# EAGLE schematic pc_sensything_lite_v1.2 (EAGLE 6.6.0)

## Sheet 1 of 2
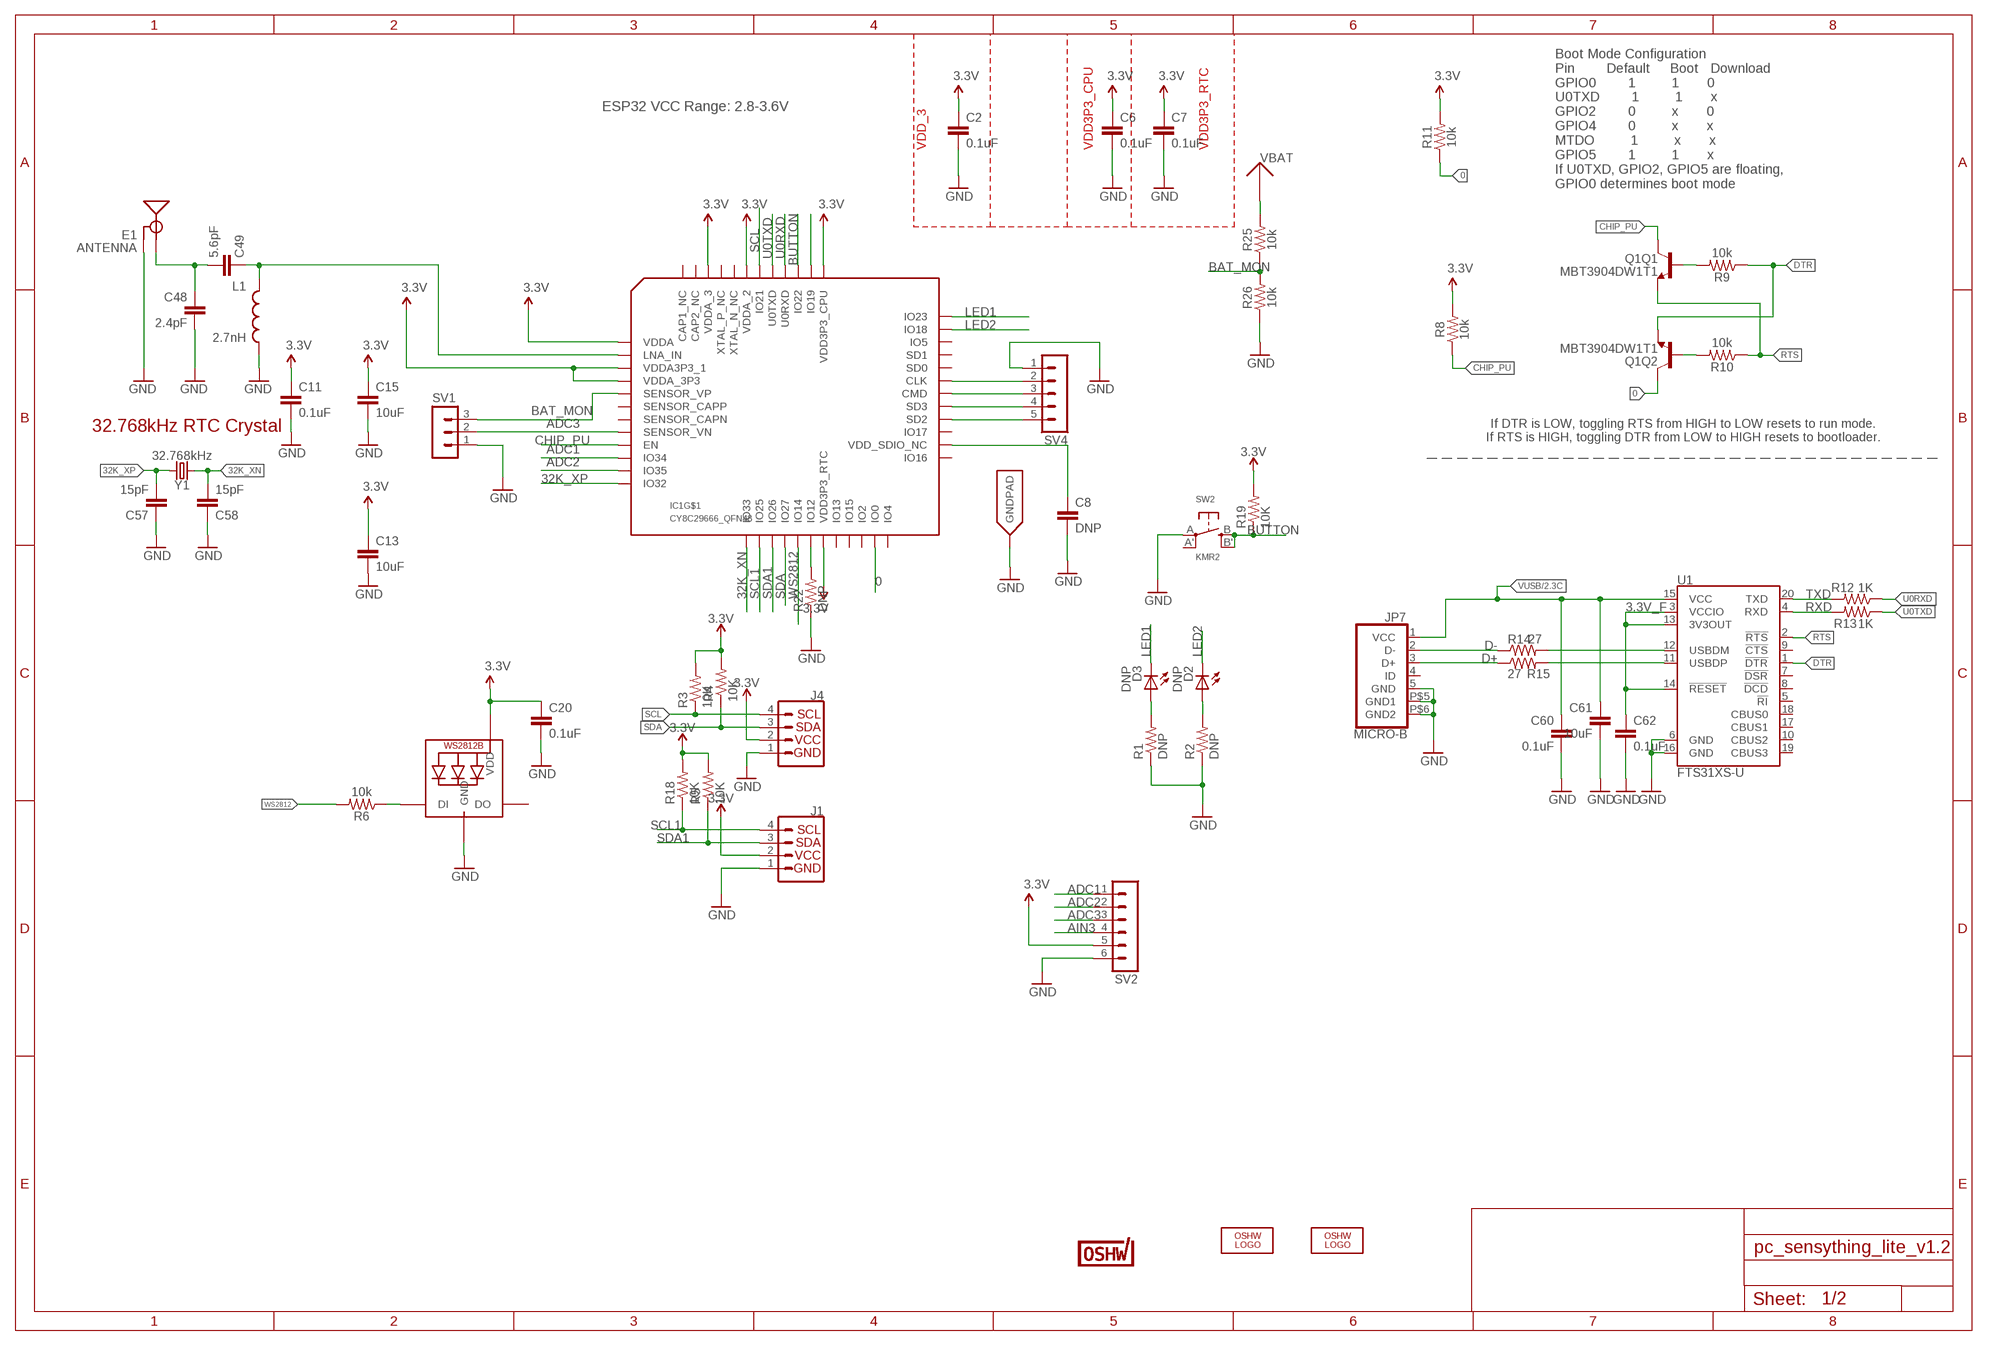
[diagram p0: schematic, sheet 1]

### Parts
C2  0.1uF  0.1UF-0402-16V-10%  [0402]
C6  0.1uF  0.1UF-0402-16V-10%  [0402]
C7  0.1uF  0.1UF-0402-16V-10%  [0402]
C8  DNP  0.1UF-0603-25V-(+80/-20%)  [0603]
C11  0.1uF  0.1UF-0402-16V-10%  [0402]
C13  10uF  C-EUC0402  [C0402]
C15  10uF  10UF-0603-6.3V-20%  [0603]
C20  0.1uF  0.1UF-0603-25V-(+80/-20%)  [0603]
C48  2.4pF  2.4PF-0603-50V-5%  [0603]
C49  5.6pF  5.6PF-50V-5%(0603)  [0603]
C57  15pF  15PF-0603-50V-5%  [0603]
C58  15pF  15PF-0603-50V-5%  [0603]
C60  0.1uF  C-EUC0402  [C0402]
C61  10uF  C-EUC0805  [C0805]
C62  0.1uF  C-EUC0402  [C0402]
D2  DNP  LEDCHIPLED_0603  [CHIPLED_0603]
D3  DNP  LEDCHIPLED_0603  [CHIPLED_0603]
E1  ANTENNA  ANTENNATRACE-TUNED  [TRACE_ANTENNA_2.4GHZ_25.7MM_TUNED]
IC1  CY8C29666_QFN48  [QFN48]
J1  QWIIC_CONNECTORJS-1MM  [1X04_1MM_RA]
J4  QWIIC_CONNECTORJS-1MM  [1X04_1MM_RA]
JP7  MICRO-B  [MICRO-B]
L1  2.7nH  INDUCTOR0603  [0603]
LED1  WS2812B5050  [WS2812B]
LOGO1  OSHW_LOGO_FILLX0200-NT  [OSHW_FILLX200_NOTEXT]
LOGO3  OSHW_LOGO_FILLX0200-NT  [OSHW_FILLX200_NOTEXT]
Q1  MBT3904DW1T1  [SC70-6]
R1  DNP  R-US_R0402  [R0402]
R2  DNP  R-US_R0402  [R0402]
R3  10K  R-US_R0402  [R0402]
R4  10K  R-US_R0402  [R0402]
R5  10K  R-US_R0402  [R0402]
R6  10k  10KOHM-1/10W-1%(0603)0603  [0603]
R8  10k  10KOHM-1/10W-1%(0603)0603  [0603]
R9  10k  10KOHM-0603-1/10W-1%  [0603]
R10  10k  10KOHM-0603-1/10W-1%  [0603]
R11  10k  10KOHM-1/10W-1%(0603)0603  [0603]
R12  1K  R-US_R0402  [R0402]
R13  1K  R-US_R0402  [R0402]
R14  27  R-US_R0402  [R0402]
R15  27  R-US_R0402  [R0402]
R18  10K  R-US_R0402  [R0402]
R19  10K  R-US_R0402  [R0402]
R22  DNP  R-US_R0402  [R0402]
R25  10k  10KOHM-1/10W-1%(0603)0603  [0603]
R26  10k  10KOHM-1/10W-1%(0603)0603  [0603]
SV1  MA03-1  [MA03-1]
SV2  MA06-1  [MA06-1]
SV4  MA05-1  [MA05-1]
SW2  KMR2  SWITCH_TACT_SMT4.6X2.8  [BTN_KMR2_4.6X2.8]
U1  FTS31XS-U  FT231XS  [SSOP20_L]
U$22  CERT-SMALL  [CERT-SMALL-SILK]
Y1  32.768kHz  CRYSTAL-32.768KHZSMD-3.2X1.5  [CRYSTAL-SMD-3.2X1.5MM]

### Nets
0: IC1.23(IO0) Q1.6(Q2:C) R11.1
3.3V: C2.1 C6.1 C7.1 C11.1 C13.1 C15.1 C20.1 IC1.1(VDDA) IC1.3(VDDA3P3_1) IC1.4(VDDA_3P3) IC1.19(VDD3P3_RTC) IC1.37(VDD3P3_CPU) IC1.43(VDDA_2) IC1.46(VDDA_3) J1.2 J4.2 LED1.1-VDD(VDD) R3.2 R4.2 R5.2 R8.2 R11.2 R18.2 R19.2 SV2.5 ; also sheet 2
3.3V_F: C62.1 U1.3(VCCIO) U1.13(3V3OUT) U1.14(!RESET)
32K_XN: C58.2 IC1.13(IO33) Y1.P$2
32K_XP: C57.2 IC1.12(IO32) Y1.P$1
ADC1: IC1.10(IO34) SV2.1
ADC2: IC1.11(IO35) SV2.2
ADC3: IC1.8(SENSOR_VN) SV1.2 SV2.3
AIN3: SV2.4
BAT_MON: IC1.5(SENSOR_VP) R25.1 R26.2 SV1.3
BUTTON: IC1.39(IO22) R19.1 SW2.B'(S1) SW2.B(S)
CHIP_PU: IC1.9(EN) Q1.3(Q1:C) R8.1
D+: JP7.3(D+) R15.1
D-: JP7.2(D-) R14.1
DTR: Q1.1(Q2:E) R9.1 U1.1(!DTR)
GND: C2.2 C6.2 C7.2 C8.2 C11.2 C13.2 C15.2 C20.2 C48.2 C57.1 C58.1 C60.2 C61.2 C62.2 E1.GND E1.GND2(GND) IC1.EXP(GNDPAD) J1.1 J4.1 JP7.5(GND) JP7.P$5(GND1) JP7.P$6(GND2) L1.2 LED1.3-GND(GND) R1.1 R2.1 R22.1 R26.1 SV1.1 SV2.6 SV4.1 SW2.A(P) U1.6(GND) U1.16(GND) ; also sheet 2
LED1: D3.C IC1.36(IO23)
LED2: D2.C IC1.35(IO18)
LNA_IN: C49.1 IC1.2(LNA_IN) L1.1
N$1: C8.1 IC1.26(VDD_SDIO_NC)
N$2: IC1.18(IO12) R22.2
N$3: D3.A R1.2
N$4: Q1.5(Q1:B) R9.2
N$5: D2.A R2.2
N$6: LED1.4-DIN(DI) R6.1
N$8: IC1.38(IO19)
N$9: Q1.2(Q2:B) R10.2
N$11: IC1.28(SD2) SV4.5
N$12: IC1.29(SD3) SV4.4
N$13: IC1.30(CMD) SV4.3
N$14: IC1.31(CLK) SV4.2
N$20: R14.2 U1.12(USBDM)
N$21: R15.2 U1.11(USBDP)
RTS: Q1.4(Q1:E) R10.1 U1.2(!RTS)
RXD: R13.2 U1.4(RXD)
SCL: IC1.42(IO21) J4.4 R3.1
SCL1: IC1.14(IO25) J1.4 R18.1
SDA: IC1.16(IO27) J4.3 R4.1
SDA1: IC1.15(IO26) J1.3 R5.1
TRACE_ANT2: C48.1 C49.2 E1.ANT(SIGNAL)
TXD: R12.2 U1.20(TXD)
U0RXD: IC1.40(U0RXD) R12.1
U0TXD: IC1.41(U0TXD) R13.1
VBAT: R25.2 ; also sheet 2
VUSB: C60.1 C61.1 JP7.1(VCC) U1.15(VCC) ; also sheet 2
WS2812: IC1.17(IO14) R6.2
Unconnected: IC1.6(SENSOR_CAPP) IC1.20(IO13) IC1.21(IO15) IC1.22(IO2) IC1.24(IO4) IC1.25(IO16) IC1.27(IO17) IC1.32(SD0) IC1.33(SD1) IC1.34(IO5) IC1.44(XTAL_N_NC) IC1.45(XTAL_P_NC) IC1.47(CAP2_NC) IC1.48(CAP1_NC) JP7.4(ID) LED1.2-DOUT(DO) SW2.A'(P1) U1.5(!RI) U1.7(!DSR) U1.8(!DCD) U1.9(!CTS) U1.10(CBUS2) U1.17(CBUS1) U1.18(CBUS0) U1.19(CBUS3)

### Notes on the sheet
- ESP32 VCC Range: 2.8-3.6V
- VDD_3 | VDD3P3_CPU | VDD3P3_RTC
- Boot Mode Configuration
  Pin        Default     Boot   Download
  GPIO0        1         1       0
  U0TXD        1         1       x
  GPIO2        0         x       0
  GPIO4        0         x       x
  MTDO         1         x       x
  GPIO5        1         1       x
  If U0TXD, GPIO2, GPIO5 are floating, 
  GPIO0 determines boot mode
- 32.768kHz RTC Crystal
- If DTR is LOW, toggling RTS from HIGH to LOW resets to run mode.
  If RTS is HIGH, toggling DTR from LOW to HIGH resets to bootloader.

## Sheet 2 of 2
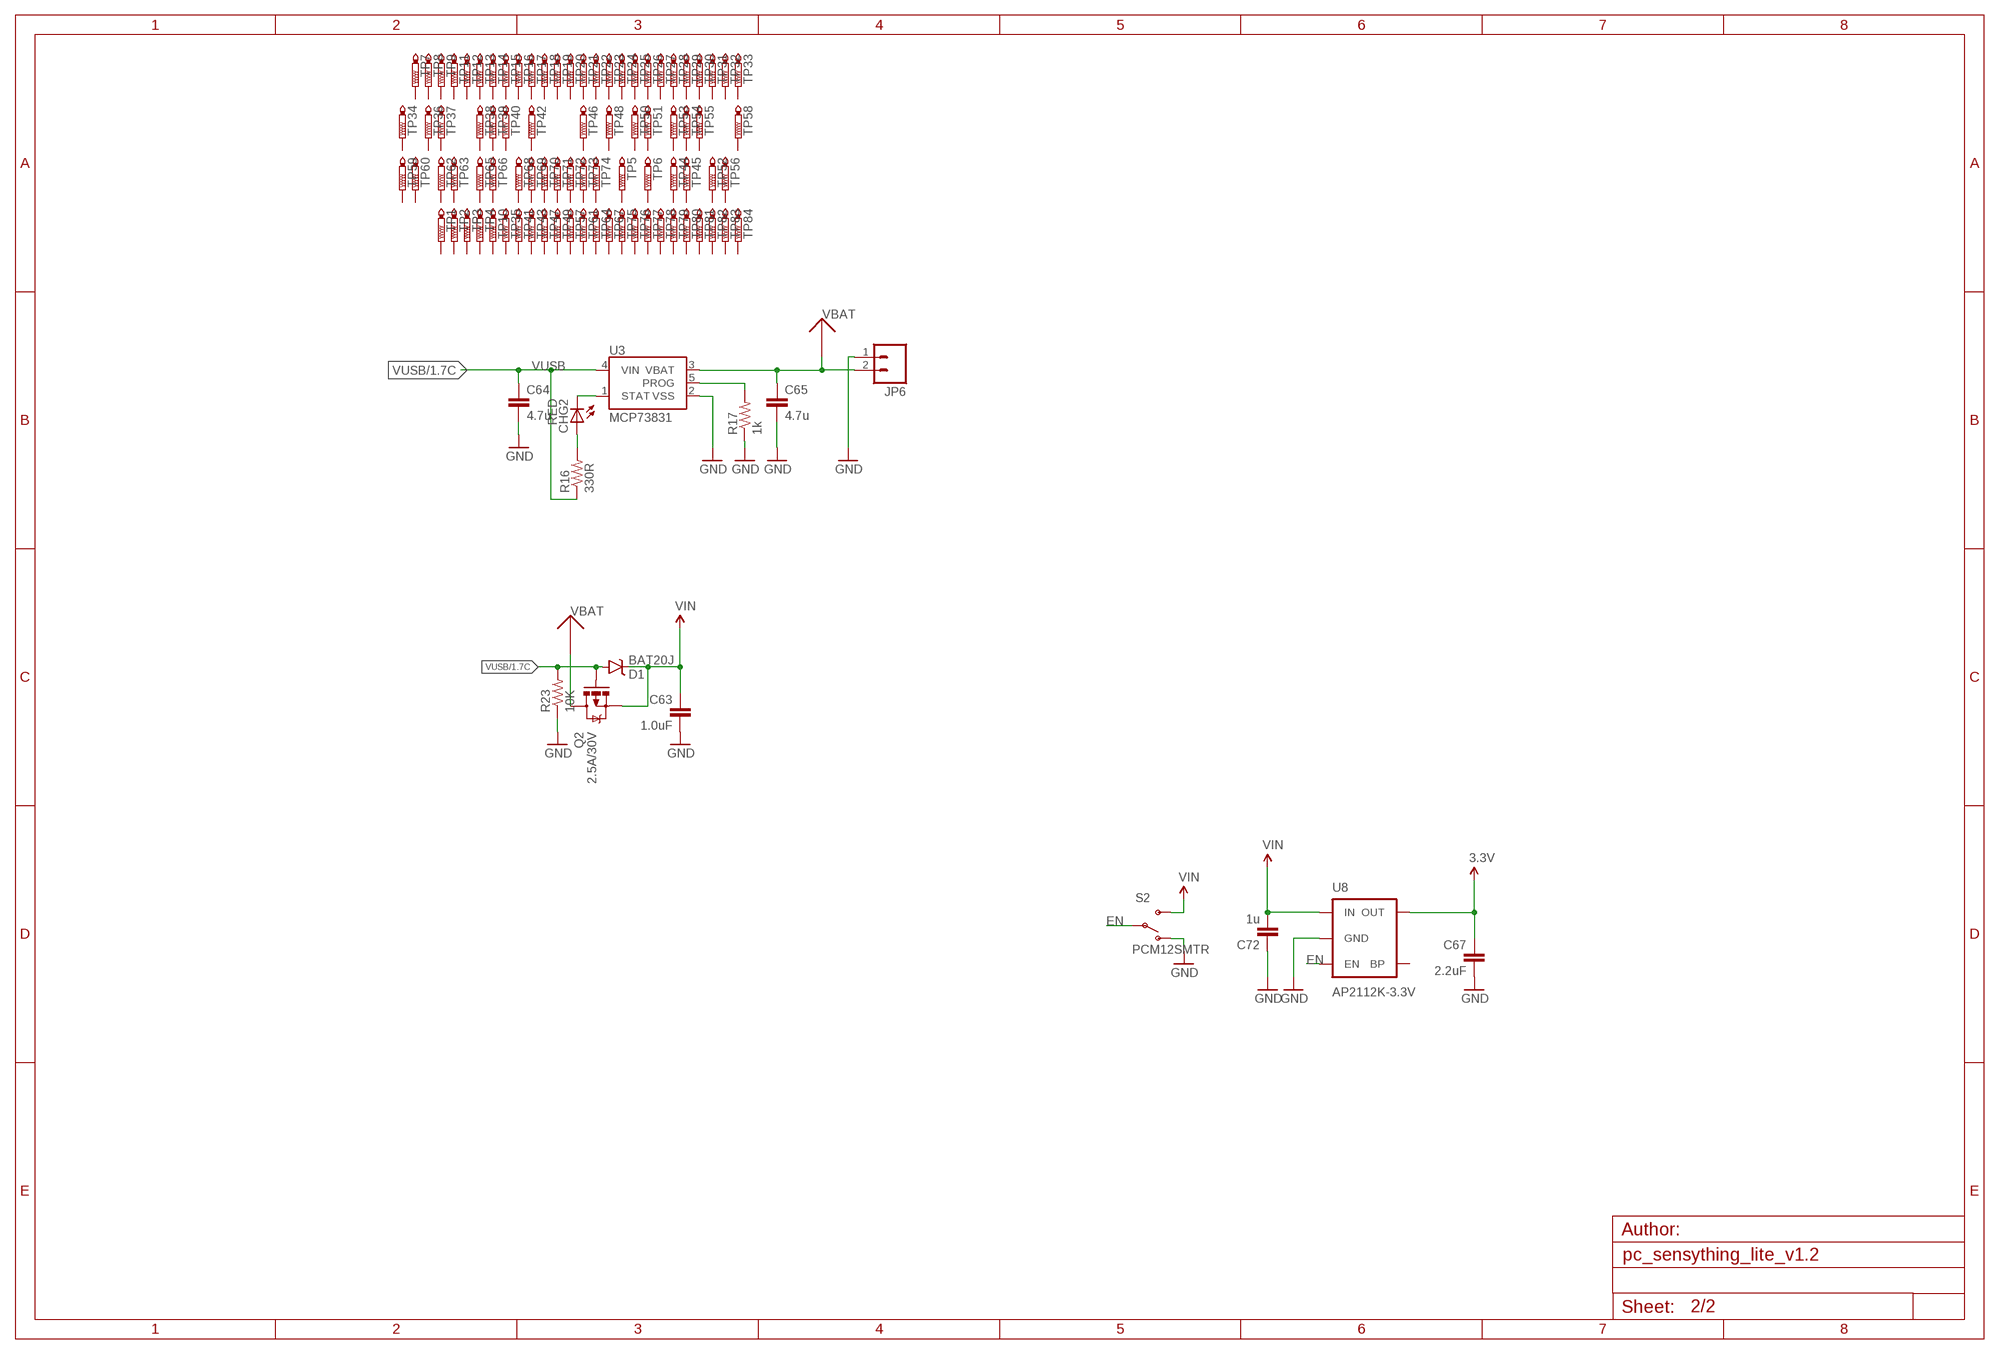
[diagram p1: schematic, sheet 2]

### Parts
C63  1.0uF  C-EUC0402  [C0402]
C64  4.7u  C-EUC0805  [C0805]
C65  4.7u  C-EUC0805  [C0805]
C67  2.2uF  C-EUC0402  [C0402]
C72  1u  C-EUC0402  [C0402]
CHG2  RED  LEDCHIPLED_0603  [CHIPLED_0603]
D1  BAT20J  DIODE-SCHOTTKY-BAT20J  [SOD-323]
JP6  M02-JST-2MM-SMT  [JST-2-SMD]
Q2  2.5A/30V  MOSFET-PCHANNELDMG2307L  [SOT23-3]
R16  330R  R-US_R0402  [R0402]
R17  1k  R-US_R0402  [R0402]
R23  10K  R-US_R0402  [R0402]
S2  PCM12SMTR  SWITCH-SPDT-SMD-A  [SWITCH-SPST-SMD-A]
TP1  PTR1PAD1-13  [P1-13]
TP2  PTR1PAD1-13  [P1-13]
TP3  PTR1PAD1-13  [P1-13]
TP4  PTR1PAD1-13  [P1-13]
TP5  PTR1PAD1-13  [P1-13]
TP6  PTR1PAD1-13  [P1-13]
TP7  PTR1PAD1-13  [P1-13]
TP8  PTR1PAD1-13  [P1-13]
TP9  PTR1PAD1-13  [P1-13]
TP10  PTR1PAD1-13  [P1-13]
TP11  PTR1PAD1-13  [P1-13]
TP12  PTR1PAD1-13  [P1-13]
TP13  PTR1PAD1-13  [P1-13]
TP14  PTR1PAD1-13  [P1-13]
TP15  PTR1PAD1-13  [P1-13]
TP16  PTR1PAD1-13  [P1-13]
TP17  PTR1PAD1-13  [P1-13]
TP18  PTR1PAD1-13  [P1-13]
TP19  PTR1PAD1-13  [P1-13]
TP20  PTR1PAD1-13  [P1-13]
TP21  PTR1PAD1-13  [P1-13]
TP22  PTR1PAD1-13  [P1-13]
TP23  PTR1PAD1-13  [P1-13]
TP24  PTR1PAD1-13  [P1-13]
TP25  PTR1PAD1-13  [P1-13]
TP26  PTR1PAD1-13  [P1-13]
TP27  PTR1PAD1-13  [P1-13]
TP28  PTR1PAD1-13  [P1-13]
TP29  PTR1PAD1-13  [P1-13]
TP30  PTR1PAD1-13  [P1-13]
TP31  PTR1PAD1-13  [P1-13]
TP32  PTR1PAD1-13  [P1-13]
TP33  PTR1PAD1-13  [P1-13]
TP34  PTR1PAD1-13  [P1-13]
TP35  PTR1PAD1-13  [P1-13]
TP36  PTR1PAD1-13  [P1-13]
TP37  PTR1PAD1-13  [P1-13]
TP38  PTR1PAD1-13  [P1-13]
TP39  PTR1PAD1-13  [P1-13]
TP40  PTR1PAD1-13  [P1-13]
TP41  PTR1PAD1-13  [P1-13]
TP42  PTR1PAD1-13  [P1-13]
TP43  PTR1PAD1-13  [P1-13]
TP44  PTR1PAD1-13  [P1-13]
TP45  PTR1PAD1-13  [P1-13]
TP46  PTR1PAD1-13  [P1-13]
TP47  PTR1PAD1-13  [P1-13]
TP48  PTR1PAD1-13  [P1-13]
TP49  PTR1PAD1-13  [P1-13]
TP50  PTR1PAD1-13  [P1-13]
TP51  PTR1PAD1-13  [P1-13]
TP52  PTR1PAD1-13  [P1-13]
TP53  PTR1PAD1-13  [P1-13]
TP54  PTR1PAD1-13  [P1-13]
TP55  PTR1PAD1-13  [P1-13]
TP56  PTR1PAD1-13  [P1-13]
TP57  PTR1PAD1-13  [P1-13]
TP58  PTR1PAD1-13  [P1-13]
TP59  PTR1PAD1-13  [P1-13]
TP60  PTR1PAD1-13  [P1-13]
TP61  PTR1PAD1-13  [P1-13]
TP62  PTR1PAD1-13  [P1-13]
TP63  PTR1PAD1-13  [P1-13]
TP64  PTR1PAD1-13  [P1-13]
TP65  PTR1PAD1-13  [P1-13]
TP66  PTR1PAD1-13  [P1-13]
TP67  PTR1PAD1-13  [P1-13]
TP68  PTR1PAD1-13  [P1-13]
TP69  PTR1PAD1-13  [P1-13]
TP70  PTR1PAD1-13  [P1-13]
TP71  PTR1PAD1-13  [P1-13]
TP72  PTR1PAD1-13  [P1-13]
TP73  PTR1PAD1-13  [P1-13]
TP74  PTR1PAD1-13  [P1-13]
TP75  PTR1PAD1-13  [P1-13]
TP76  PTR1PAD1-13  [P1-13]
TP77  PTR1PAD1-13  [P1-13]
TP78  PTR1PAD1-13  [P1-13]
TP79  PTR1PAD1-13  [P1-13]
TP80  PTR1PAD1-13  [P1-13]
TP81  PTR1PAD1-13  [P1-13]
TP82  PTR1PAD1-13  [P1-13]
TP83  PTR1PAD1-13  [P1-13]
TP84  PTR1PAD1-13  [P1-13]
U3  MCP73831  [SOT23-5]
U8  AP2112K-3.3V  V_REG_LDOSMD  [SOT23-5]

### Nets
3.3V: C67.1 U8.5(OUT) ; also sheet 1
EN: S2.2(P) U8.3(EN)
GND: C63.2 C64.2 C65.2 C67.2 C72.1 JP6.1 R17.1 R23.1 S2.1(O) U3.2(VSS) U8.2(GND) ; also sheet 1
N$22: CHG2.C U3.1(STAT)
N$29: CHG2.A R16.2
N$31: R17.2 U3.5(PROG)
VBAT: C65.1 JP6.2 Q2.3(D) U3.3(VBAT) ; also sheet 1
VIN: C63.1 C72.2 D1.C Q2.2(S) S2.3(S) U8.1(IN)
VUSB: C64.1 D1.A Q2.1(G) R16.1 R23.2 U3.4(VIN) ; also sheet 1
Unconnected: TP1.TP TP2.TP TP3.TP TP4.TP TP5.TP TP6.TP TP7.TP TP8.TP TP9.TP TP10.TP TP11.TP TP12.TP TP13.TP TP14.TP TP15.TP TP16.TP TP17.TP TP18.TP TP19.TP TP20.TP TP21.TP TP22.TP TP23.TP TP24.TP TP25.TP TP26.TP TP27.TP TP28.TP TP29.TP TP30.TP TP31.TP TP32.TP TP33.TP TP34.TP TP35.TP TP36.TP TP37.TP TP38.TP TP39.TP TP40.TP TP41.TP TP42.TP TP43.TP TP44.TP TP45.TP TP46.TP TP47.TP TP48.TP TP49.TP TP50.TP TP51.TP TP52.TP TP53.TP TP54.TP TP55.TP TP56.TP TP57.TP TP58.TP TP59.TP TP60.TP TP61.TP TP62.TP TP63.TP TP64.TP TP65.TP TP66.TP TP67.TP TP68.TP TP69.TP TP70.TP TP71.TP TP72.TP TP73.TP TP74.TP TP75.TP TP76.TP TP77.TP TP78.TP TP79.TP TP80.TP TP81.TP TP82.TP TP83.TP TP84.TP U8.4(BP)

## Power pins joined to a net without a drawn wire
SENSOR_CAPN: IC1.7(SENSOR_CAPN)

## Library data of the parts
C2 C6 C7 C11 = SparkFun-Capacitors:0.1UF: 0.1µF ceramic capacitors A capacitor is a passive two-terminal electrical component used to store electrical energy temporarily in an electric field.; PROD_ID: CAP-12416
C8 = SparkFun-Capacitors:0.1UF: 0.1µF ceramic capacitors A capacitor is a passive two-terminal electrical component used to store electrical energy temporarily in an electric field.; PROD_ID: CAP-00810; VALUE: 0.1uF
C13 C60-C65 C67 C72 = rcl:C-EU: CAPACITOR, European symbol
C15 = SparkFun-Capacitors:10UF: 10.0µF ceramic capacitors A capacitor is a passive two-terminal electrical component used to store electrical energy temporarily in an electric field.; PROD_ID: CAP-11015
C20 = SparkFun-Capacitors:0.1UF: 0.1µF ceramic capacitors A capacitor is a passive two-terminal electrical component used to store electrical energy temporarily in an electric field.; PROD_ID: CAP-00810
C48 = esp32-thing-temp:2.4PF: 2.4pF ceramic capacitors A capacitor is a passive two-terminal electrical component used to store electrical energy temporarily in an electric field.; PROD_ID: CAP-13541
C49 = esp32-thing-temp:5.6PF-50V-5%(0603): CAP-12456; PROD_ID: CAP-12456
C57 C58 = SparkFun-Capacitors:15PF: 15pF ceramic capacitors A capacitor is a passive two-terminal electrical component used to store electrical energy temporarily in an electric field.; PROD_ID: CAP-07881
CHG2 D2 D3 = led:LED: LED OSRAM: - CHIPLED LG R971, LG N971, LY N971, LG Q971, LY Q971, LO R971, LY R971 LH N974, LH R974 LS Q976, LO Q976, LY Q976 LO Q996 - Hyper CHIPLED LW Q18S LB Q993, LB Q99A, LB R99A - SideLED LS A670, LO A670, LY A670, LG A670, LP A670 LB A673, LV A673, LT A673, LW A673 LH A674 LY A675 LS A676, LA A676, LO A676, LY A676, LW A676 LS A679, LY A679, LG A679 - Hyper Micro SIDELED® LS Y876, LA Y876, LO Y876, LY Y876 LT Y87S - SmartLED LW L88C, LW L88S LB L89C, LB L89S, LG L890 LS L89K, LO L89K, LY L89K LS L896, LA L896, LO L896, LY L896 - TOPLED LS T670, LO T670, LY T670, LG T670, LP T670 LSG T670, LSP T670, LSY T670, LOP T670, LYG T670 LG T671, LOG T671, LSG T671 LB T673, LV T673, LT T673, LW T673 LH T674 LS T676, LA T676, LO T676, LY T676, LB T676, LH T676, LSB T676, LW T676 LB T67C, LV T67C, LT T67C, LS T67K, LO T67K, LY T67K, LW E67C LS E67B, LA E67B, LO E67B, LY E67B, LB E67C, LV E67C, LT E67C LW T67C LS T679, LY T679, LG T679 LS T770, LO T770, LY T770, LG T770, LP T770 LB T773, LV T773, LT T773, LW T773 LH T774 LS E675, LA E675, LY E675, LS T675 LS T776, LA T776, LO T776, LY T776, LB T776 LHGB T686 LT T68C, LB T68C - Hyper Mini TOPLED® LB M676 - Mini TOPLED Santana® LG M470 LS M47K, LO M47K, LY M47K Source: http://www.osram.convergy.de LUXEON: - LUMILED® LXK2-PW12-R00, LXK2-PW12-S00, LXK2-PW14-U00, LXK2-PW14-V00 LXK2-PM12-R00, LXK2-PM12-S00, LXK2-PM14-U00 LXK2-PE12-Q00, LXK2-PE12-R00, LXK2-PE12-S00, LXK2-PE14-T00, LXK2-PE14-U00 LXK2-PB12-K00, LXK2-PB12-L00, LXK2-PB12-M00, LXK2-PB14-N00, LXK2-PB14-P00, LXK2-PB14-Q00 LXK2-PR12-L00, LXK2-PR12-M00, LXK2-PR14-Q00, LXK2-PR14-R00 LXK2-PD12-Q00, LXK2-PD12-R00, LXK2-PD12-S00 LXK2-PH12-R00, LXK2-PH12-S00 LXK2-PL12-P00, LXK2-PL12-Q00, LXK2-PL12-R00 Source: www.luxeon.com KINGBRIGHT: KA-3528ASYC Source: www.kingbright.com
D1 = SparkFun-DiscreteSemi:DIODE-SCHOTTKY: Schottky diodes in SFE's production catalog BAT20J 1A 23V 0.62Vf RB751 120mA 40V 0.37Vf PMEG4005EJ 0.5A 40V 0.42Vf MBRA140 1A 40V 0.5Vf B340A 3A 40V SMA; PROD_ID: DIO-11623
E1 = esp32-thing-temp:ANTENNA: Chip antenna Chip antenna with ground or secondary connection. Common with larger metal RF connectors.
IC1 = cypresspsoc_0.30:CY8C29666_QFN48
J1 J4 = SparkFun-Connectors:QWIIC_CONNECTOR: SparkFun I2C Standard Qwiic Connector An SMD 1mm pitch JST connector makes it easy and quick (get it? Qwiic?) to connect I2C devices to each other. The Qwiic system <http://www.sparkfun.com/qwiic> enables fast and solderless connection between popular platforms and various sensors and actuators. We carry 200mm <https://www.sparkfun.com/products/14204>, 100mm <https://www.sparkfun.com/products/14205>, 50mm <https://www.sparkfun.com/products/14206>, and breadboard friendly <https://www.sparkfun.com/products/14207> Qwiic cables. We also offer 10 pcs strips <https://www.sparkfun.com/products/14323> the SMD connectors.; PROD_ID: CONN-13694
JP6 = SparkFun:M02: Header 2 Standard 2-pin 0.1" header. Use with straight break away headers (SKU : PRT-00116), right angle break away headers (PRT-00553), swiss pins (PRT-00743), machine pins (PRT-00117), and female headers (PRT-00115). Molex polarized connector foot print use with SKU : PRT-08233 with associated crimp pins and housings.
JP7 = circuitects:MICRO-B
L1 = SparkFun-Passives:INDUCTOR: Inductors Basic Inductor/Choke - 0603 and 1206. Footprints are not proven and vary greatly between part numbers. INDUCTOR POWER 3.3UH 4.0A SMD 0.197" L x 0.197" W x 0.177" H (5.00mm x 5.00mm x 4.50mm); PROD_ID: NDUC-08762
LED1 = adafruit:WS2812B
LOGO1 LOGO3 = ohw-logo:OSHW_LOGO_FILL
Q1 = esp32-thing-temp:MBT3904DW1T1: MBT3904DW1 Dual NPN Transistors The MBT3904W1 puts two general purpose 3904 NPN transistors in a single package. Datasheet <http://www.onsemi.com/pub_link/Collateral/MBT3904DW1T1-D.PDF>; PROD_ID: TRANS-13337
Q2 = SparkFun-DiscreteSemi:MOSFET-PCHANNEL: Generic PMOSFET IRLML2244 - TRANS-11153 (SOT-23 -20V -4.3A) (1.Gate 2.Source 3.Drain) FQP27P06 - COM-10349 <http://www.sparkfun.com/products/10349> (TO-220 -60V -27A) (1.Gate 2.Source 3.Drain); PROD_ID: TRANS-11308
R1-R5 R12-R19 R22 R23 = rcl:R-US_: RESISTOR, American symbol
R6 R8 R11 R25 R26 = SparkFun-Resistors:10KOHM-1/10W-1%(0603): RES-00824; PROD_ID: RES-00824; VALUE: 10K
R9 R10 = SparkFun-Resistors:10KOHM: 10kΩ resistor A resistor is a passive two-terminal electrical component that implements electrical resistance as a circuit element. Resistors act to reduce current flow, and, at the same time, act to lower voltage levels within circuits. - Wikipedia; PROD_ID: RES-00824
S2 = SparkFun-Electromechanical:SWITCH-SPDT: SPDT Switch Simple slide switch, Spark Fun Electronics SKU : COM-00102 DPDT SMT slide switch, AYZ0202, SWCH-08179; PROD_ID: SWCH-10651
SV1 = con-lstb:MA03-1: PIN HEADER; OC_FARNELL: unknown; OC_NEWARK: unknown
SV2 = con-lstb:MA06-1: PIN HEADER; OC_FARNELL: unknown; OC_NEWARK: unknown
SV4 = con-lstb:MA05-1: PIN HEADER; OC_FARNELL: unknown; OC_NEWARK: unknown
SW2 = microbuilder:SWITCH_TACT_SMT: SMT Tact Switches 6x6mm - Digikey: P12940SCT-ND KMR2 (4.6x2.8mm) - Digikey: 401-1426-1-ND EVQ-PQHB55 - Light Touch, 160GF (4.5x4.5mm) - Digikey: P8090SCT-ND KMT0 - KMT021 NGJ LHS (etc.) IP68/Waterproof - Digikey: CKN10289CT-ND
TP1-TP84 = testpad:PTR1: TEST PIN
U1 = SparkFun-DigitalIC:FT231X: FTDI FT231X Full Speed USB to Full-handshake UART This USB2.0 Full Speed IC offers a compact bridge to full handshake UART interfaces. The device is a UART, capable of operating up to 3MBaud, with low power consumption (8mA). The FT231X includes the complete FT-X series feature set and enables USB to be added into a system design quickly and easily over a UART interface.; PROD_ID: IC-11524; VALUE: FT231XS
U3 = SparkFun:MCP73831: Microchip's MCP73831 Miniature single cell, fully integrated Li-Ion, Li-polymer charge management controller http://ww1.microchip.com/downloads/en/DeviceDoc/21984a.pdf
U8 = SparkFun-PowerIC:V_REG_LDO: Voltage Regulator LDO Standard 150mA LDO voltage regulator in SOT-23 layout. Micrel part MIC5205. BP (by-pass) pin is used to lower output noise with 470pF cap.; PROD_ID: VREG-12457
U$22 = OSHWA:CERT
Y1 = SparkFun-Clocks:CRYSTAL-32.768KHZ: 32.768kHz Crystal Frequency: 32.768kHz Frequency Stability: ±20ppm Load Capacitance: 12.5pF (PTH-2X6 & SMD-3.2X1.5), 6pF (SMD-2X6); PROD_ID: XTAL-13062

## Net classes
2 gnd: width 0.102 mm, drill 0.1 mm
4 USBpair: width 0.102 mm, drill 0.1 mm, clearance 0.15 mm to class 3